# Altium schematic sheet ABM8-27.120MHZ-B4-T.SchDoc
size A; SheetNumber: 6; SheetTotal: 8
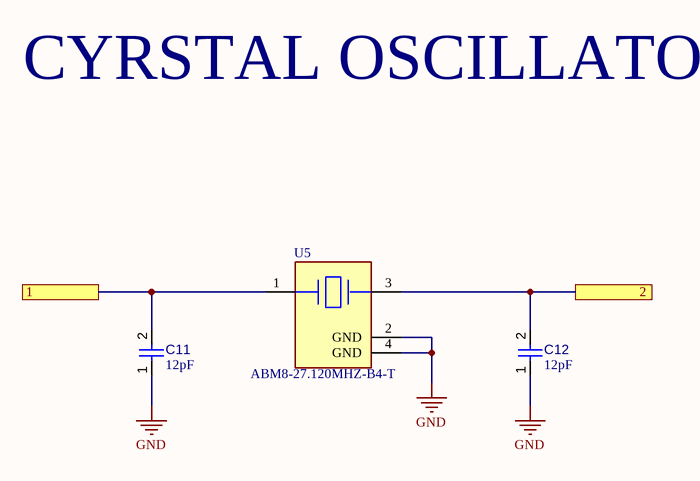
[diagram p0: ABM8-27.120MHZ-B4-T.SchDoc]

## Parts
C11  value 12pF  [CAPC0402(1005)33_L]  (hidden comment: Capacitor 12pF +/-10% 50V 0402)
C12  value 12pF  [CAPC0402(1005)33_L]  (hidden comment: Capacitor 12pF +/-10% 50V 0402)
U5  ABM8-27.120MHZ-B4-T  [FP-ABM8-MFG]

## Ports
1 (see mainsheet[2B]), 2 (see mainsheet[2B])

## Nets
GND: C11.1 C12.1 U5.2(GND) U5.4(GND)
1: C11.2 U5.1 ; port 1
2: C12.2 U5.3 ; port 2

## Notes on the sheet
- CYRSTAL OSCILLATOR

## Library data of the parts
C11 C12 = CMP-001-00072-4: Chip Capacitor, 12pF +/-10%, 50V, 0402, Thickness 0.33 mm; Tolerance: 20%; Pins: 2; Max Operating Temperature: 85°C; Case/Package: 0402; Voltage Rating: 50V; Mounting Technology: SMT; Min Operating Temperature: -55°C
U5 = CMP-27762-000994-1: Crystal 27.12MHz ±30ppm 18pF SMD-4 3.2mm x 2.5mm; ESR (Equivalent Series Resistance): 50R; Frequency Stability: 50ppm; Capacitance: 1.8E-11F; Height: 0.031inch; Load Capacitance: 18pF; Width: 0.098inch; Packaging: Tape and Reel; Lead Free: Lead Free; Frequency Tolerance: 30ppm; Max Operating Temperature: 70°C; Length: 0.126inch; Case/Package: SMD/SMT; Mount: Surface Mount; Min Operating Temperature: -20°C; RoHS Compliant: Yes; Frequency: 27.12MHz